# EAGLE design rc2014_16550c (EAGLE 8.1.1)
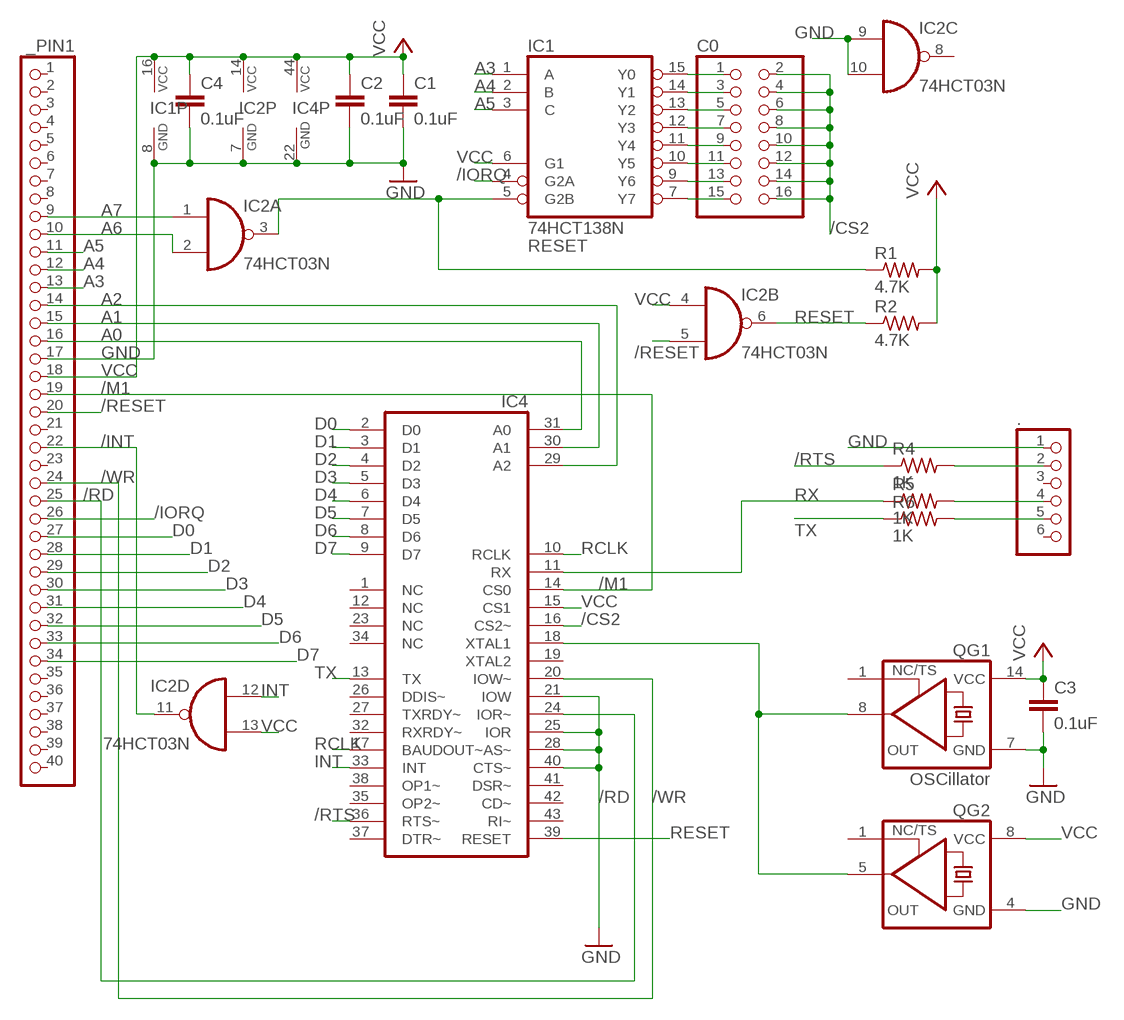
[diagram p0: schematic, sheet 1]

## Parts
.  PINHD-1X6  [1X06]
_PIN1  PINHD-1X40  [1X40]
C0  PINHD-2X8  [2X08]
C1  0.1uF  C-EU050-024X044  [C050-024X044]
C2  0.1uF  C-EU050-024X044  [C050-024X044]
C3  0.1uF  C-EU050-024X044  [C050-024X044]
C4  0.1uF  C-EU050-024X044  [C050-024X044]
IC1  74HCT138N  [DIL16]
IC2  74HCT03N  74HCT00N  [DIL14]
IC4  XR-16C550JSOCKET44  [S44]
QG1  OSCillator  XO-14  [DIL14S]
QG2  XO-8  [DIL08S]
R1  4.7K  R-US_0207/10  [0207/10]
R2  4.7K  R-US_0207/10  [0207/10]
R4  1K  R-US_0207/10  [0207/10]
R5  1K  R-US_0207/10  [0207/10]
R6  1K  R-US_0207/10  [0207/10]

## Nets
/CS2: C0.2 C0.4 C0.6 C0.8 C0.10 C0.12 C0.14 C0.16 IC4.16(CS2~)
/INT: _PIN1.22 IC2.11(D:O)
/IORQ: _PIN1.26 IC1.4(G2A)
/M1: _PIN1.19 IC4.14(CS0)
/RD: _PIN1.25 IC4.24(IOR~)
/RESET: _PIN1.20 IC2.5(B:I1)
/RTS: IC4.36(RTS~) R4.1
/WR: _PIN1.24 IC4.20(IOW~)
A0: _PIN1.16 IC4.31(A0)
A1: _PIN1.15 IC4.30(A1)
A2: _PIN1.14 IC4.29(A2)
A3: _PIN1.13 IC1.1(A)
A4: _PIN1.12 IC1.2(B)
A5: _PIN1.11 IC1.3(C)
A6: _PIN1.10 IC2.2(A:I1)
A7: _PIN1.9 IC2.1(A:I0)
CS1: IC1.5(G2B) IC2.3(A:O) R1.1
D0: _PIN1.27 IC4.2(D0)
D1: _PIN1.28 IC4.3(D1)
D2: _PIN1.29 IC4.4(D2)
D3: _PIN1.30 IC4.5(D3)
D4: _PIN1.31 IC4.6(D4)
D5: _PIN1.32 IC4.7(D5)
D6: _PIN1.33 IC4.8(D6)
D7: _PIN1.34 IC4.9(D7)
GND: ..1 _PIN1.17 C1.2 C2.2 C3.2 C4.2 IC1.8(GND) IC2.7(P:GND) IC2.9(C:I0) IC2.10(C:I1) IC4.21(IOW) IC4.22(GND) IC4.25(IOR) IC4.28(AS~) IC4.40(CTS~) QG1.7(GND) QG2.4(GND)
INT: IC2.12(D:I0) IC4.33(INT)
N$3: ..5 R6.2
N$4: ..4 R5.2
N$5: ..2 R4.2
N$6: C0.1 IC1.15(Y0)
N$7: C0.3 IC1.14(Y1)
N$8: C0.5 IC1.13(Y2)
N$9: C0.7 IC1.12(Y3)
N$10: C0.9 IC1.11(Y4)
N$11: C0.11 IC1.10(Y5)
N$12: C0.13 IC1.9(Y6)
N$13: C0.15 IC1.7(Y7)
OSC: IC4.18(XTAL1) QG1.8(OUT) QG2.5(OUT)
RCLK: IC4.10(RCLK) IC4.17(BAUDOUT~)
RESET: IC2.6(B:O) IC4.39(RESET) R2.1
RX: IC4.11(RX) R5.1
TX: IC4.13(TX) R6.1
VCC: _PIN1.18 C1.1 C2.1 C3.1 C4.1 IC1.6(G1) IC1.16(VCC) IC2.4(B:I0) IC2.13(D:I1) IC2.14(P:VCC) IC4.15(CS1) IC4.44(VCC) QG1.14(VCC) QG2.8(VCC) R1.2 R2.2
Unconnected: ..3 ..6 _PIN1.1 _PIN1.2 _PIN1.3 _PIN1.4 _PIN1.5 _PIN1.6 _PIN1.7 _PIN1.8 _PIN1.21 _PIN1.23 _PIN1.35 _PIN1.36 _PIN1.37 _PIN1.38 _PIN1.39 _PIN1.40 IC2.8(C:O) IC4.1(NC) IC4.12(NC) IC4.19(XTAL2) IC4.23(NC) IC4.26(DDIS~) IC4.27(TXRDY~) IC4.32(RXRDY~) IC4.34(NC) IC4.35(OP2~) IC4.37(DTR~) IC4.38(OP1~) IC4.41(DSR~) IC4.42(CD~) IC4.43(RI~) QG1.1(TS) QG2.1(TS)

## Library data of the parts
. = pinhead:PINHD-1X6: PIN HEADER
_PIN1 = pinhead:PINHD-1X40: PIN HEADER
C0 = pinhead:PINHD-2X8: PIN HEADER
C1-C4 = rcl:C-EU: CAPACITOR, European symbol
IC1 = 74xx-eu:74*138: 3-line to 8-line DECODER/DEMULTIPLEXER
IC2 = 74xx-eu:74*00: Quad 2-input NAND gate
IC4 = rc2014:XR-16C550J: UART/FIFO
QG1 QG2 = crystal:XO-: CRYSTAL; OC_FARNELL: unknown; OC_NEWARK: unknown
R1 R2 R4-R6 = rcl:R-US_: RESISTOR, American symbol

## Net classes
0 +5V: width 0.508 mm

## Board
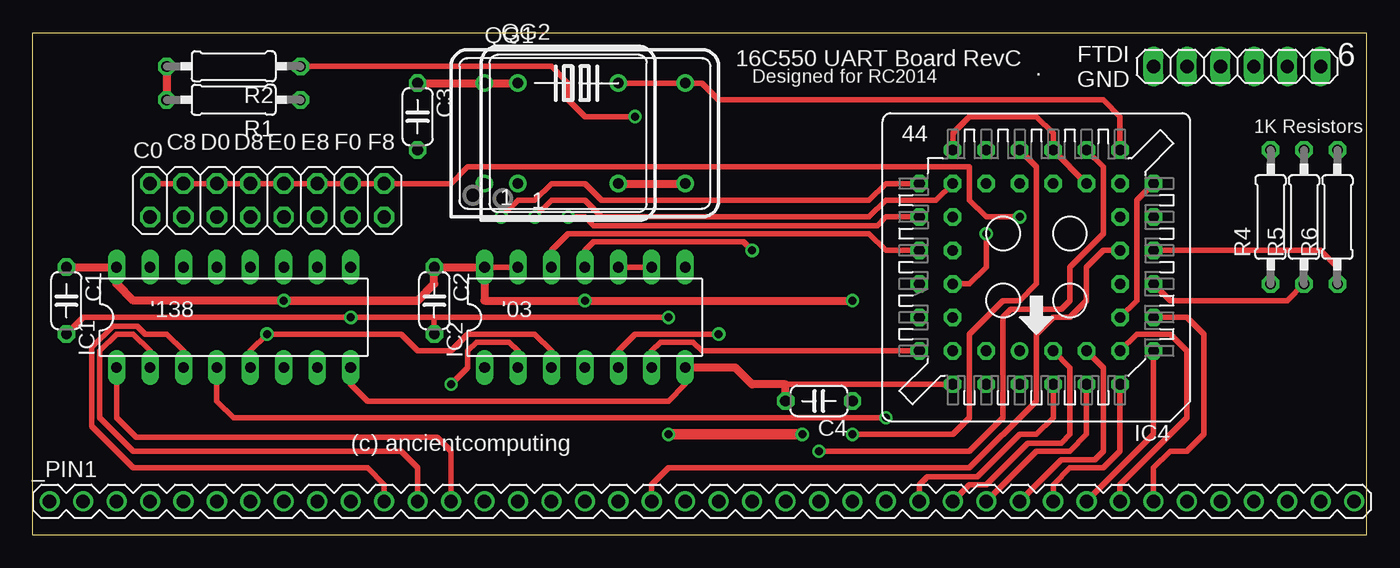
[diagram p1: board, top side]
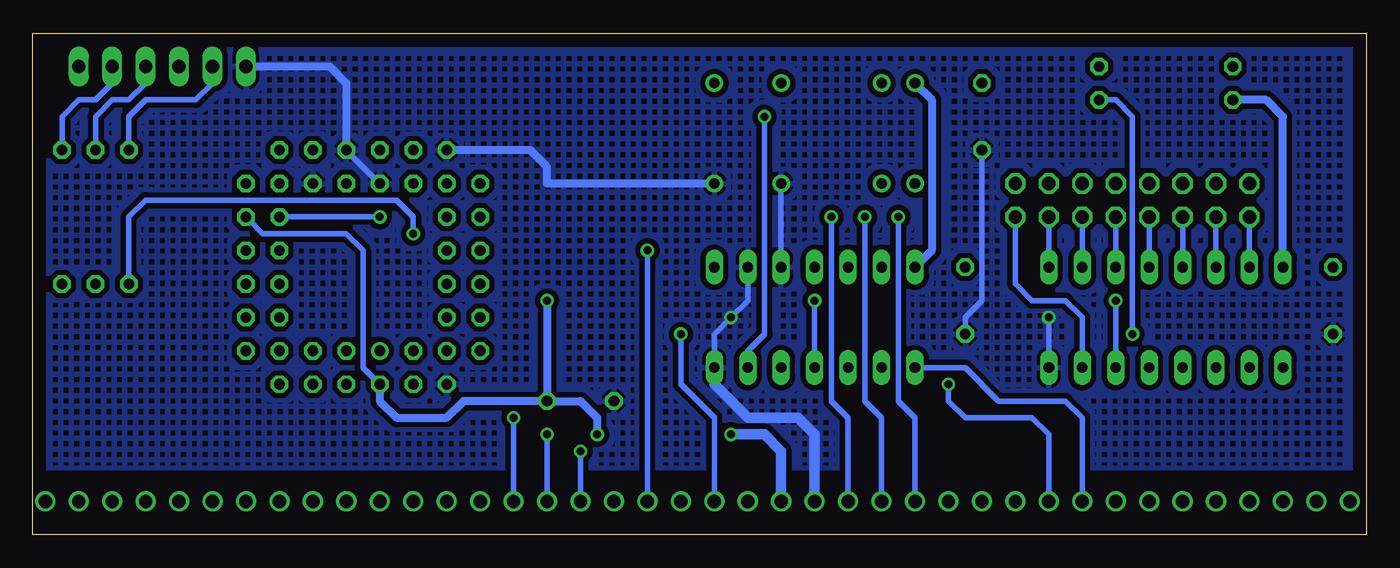
[diagram p2: board, bottom side, seen from below]

Size 101.27 x 38.1 mm. Coordinates in mm from the lower left corner, seen from the top.
Outline: 0,38.09 101.27,38.09 101.27,0 0,0 0,38.09
Outline: 0,38.09 0,38.1
Copper layers (1*16): Top 0.035mm / dielectric 1.5mm / Bottom 0.035mm
Design rules "default *": minimum track width 20mil, minimum drill 24mil, track to track 8mil, track to pad 8mil, pad to pad 8mil, via to via 8mil, smd to smd 8mil, copper to edge 40mil, drill to drill 8mil, minimum pad ring 10mil, minimum via ring 8mil, stop-mask expansion 4mil, vias tented up to drill 0mil, thermal gap 10mil

### Footprints (pad centres in the part's own frame; a part is rotated, then mirrored left to right if it is on the bottom)
1X06 = drill 1.016 long: 1 -6.35,0; 2 -3.81,0; 3 -1.27,0; 4 1.27,0; 5 3.81,0; 6 6.35,0
1X40 = drill 1.016: 1 -49.53,0; 2 -46.99,0; 3 -44.45,0; 4 -41.91,0; 5 -39.37,0; 6 -36.83,0; 7 -34.29,0; 8 -31.75,0; 9 -29.21,0; 10 -26.67,0; 11 -24.13,0; 12 -21.59,0; 13 -19.05,0; 14 -16.51,0; 15 -13.97,0; 16 -11.43,0; 17 -8.89,0; 18 -6.35,0; 19 -3.81,0; 20 -1.27,0; 21 1.27,0; 22 3.81,0; 23 6.35,0; 24 8.89,0; 25 11.43,0; 26 13.97,0; 27 16.51,0; 28 19.05,0; 29 21.59,0; 30 24.13,0; 31 26.67,0; 32 29.21,0; 33 31.75,0; 34 34.29,0; 35 36.83,0; 36 39.37,0; 37 41.91,0; 38 44.45,0; 39 46.99,0; 40 49.53,0
2X08 = drill 1.016 octagon: 1 -8.89,-1.27; 2 -8.89,1.27; 3 -6.35,-1.27; 4 -6.35,1.27; 5 -3.81,-1.27; 6 -3.81,1.27; 7 -1.27,-1.27; 8 -1.27,1.27; 9 1.27,-1.27; 10 1.27,1.27; 11 3.81,-1.27; 12 3.81,1.27; 13 6.35,-1.27; 14 6.35,1.27; 15 8.89,-1.27; 16 8.89,1.27
C050-024X044 = drill 0.813 octagon: 1 -2.54,0; 2 2.54,0
DIL16 = drill 0.813 long: 1 -8.89,-3.81; 2 -6.35,-3.81; 3 -3.81,-3.81; 4 -1.27,-3.81; 5 1.27,-3.81; 6 3.81,-3.81; 7 6.35,-3.81; 8 8.89,-3.81; 9 8.89,3.81; 10 6.35,3.81; 11 3.81,3.81; 12 1.27,3.81; 13 -1.27,3.81; 14 -3.81,3.81; 15 -6.35,3.81; 16 -8.89,3.81
DIL14 = drill 0.813 long: 1 -7.62,-3.81; 2 -5.08,-3.81; 3 -2.54,-3.81; 4 0,-3.81; 5 2.54,-3.81; 6 5.08,-3.81; 7 7.62,-3.81; 8 7.62,3.81; 9 5.08,3.81; 10 2.54,3.81; 11 0,3.81; 12 -2.54,3.81; 13 -5.08,3.81; 14 -7.62,3.81
S44 = drill 0.813: 1 1.27,6.35 | drill 0.813 octagon: 2 -1.27,8.89; 3 -1.27,6.35; 4 -3.81,8.89; 5 -3.81,6.35; 6 -6.35,8.89; 7 -8.89,6.35; 8 -6.35,6.35; 9 -8.89,3.81; 10 -6.35,3.81; 11 -8.89,1.27; 12 -6.35,1.27; 13 -8.89,-1.27; 14 -6.35,-1.27; 15 -8.89,-3.81; 16 -6.35,-3.81; 17 -8.89,-6.35; 18 -6.35,-8.89; 19 -6.35,-6.35; 20 -3.81,-8.89; 21 -3.81,-6.35; 22 -1.27,-8.89; 23 -1.27,-6.35; 24 1.27,-8.89; 25 1.27,-6.35; 26 3.81,-8.89; 27 3.81,-6.35; 28 6.35,-8.89; 29 8.89,-6.35; 30 6.35,-6.35; 31 8.89,-3.81; 32 6.35,-3.81; 33 8.89,-1.27; 34 6.35,-1.27; 35 8.89,1.27; 36 6.35,1.27; 37 8.89,3.81; 38 6.35,3.81; 39 8.89,6.35; 40 6.35,8.89; 41 6.35,6.35; 42 3.81,8.89; 43 3.81,6.35; 44 1.27,8.89
DIL14S = drill 0.813: 1 -7.62,-3.81; 7 7.62,-3.81; 8 7.62,3.81; 14 -7.62,3.81
DIL08S = drill 0.813: 1 -3.81,-3.81; 4 3.81,-3.81; 5 3.81,3.81; 8 -3.81,3.81
0207/10 = drill 0.813 octagon: 1 -5.08,0; 2 5.08,0

### Placement (x,y rotation side)
.  91.44,35.56 0 top
_PIN1  50.8,2.54 0 top
C0  17.78,25.4 0 top
C1  2.54,17.78 270 top
C2  30.48,17.78 270 top
C3  29.21,31.75 270 top
C4  59.69,10.16 180 top
IC1  15.24,16.51 0 top
IC2  41.91,16.51 0 top
IC4  76.2,20.32 180 top
QG1  41.91,30.48 0 top
QG2  40.64,30.48 0 top
R1  15.24,33.02 180 top
R2  15.24,35.56 180 top
R4  93.98,24.13 90 top
R5  96.52,24.13 90 top
R6  99.06,24.13 90 top

### Tracks (layer width: path | path; a pad name or v marks a point on that pad's centre or on a via)
/CS2  (via drill 0.61)
  Top 0.406: C0.2 C0.4 C0.6 C0.8 C0.10 C0.12 C0.14 C0.16 31.75,26.67 33.02,27.94 71.12,27.94 71.12,25.4 72.39,24.13 v74.93,24.13
  Bottom 0.406: v74.93,24.13 IC4.16
/INT  (via drill 0.61)
  Top 0.406: IC2.11 41.91,21.59 42.57,22.25 53.95,22.25 v54.61,21.59
  Bottom 0.406: _PIN1.22 v54.61,21.59
/IORQ  (via drill 0.61)
  Top 0.406: v64.77,8.89 15.24,8.89 13.97,10.16 IC1.4
  Bottom 0.406: _PIN1.26 v64.77,8.89
/M1
  Top 0.406: IC4.14 81.28,21.59 80.01,20.32 80.01,17.78 78.74,16.51 77.47,16.51 76.2,15.24 76.2,10.16 71.12,5.08 48.26,5.08 46.99,3.81 _PIN1.19
/RD  (via drill 0.61)
  Top 0.406: IC4.24 76.2,27.94 76.2,19.05 74.93,17.78 73.66,17.78 71.12,15.24 71.12,8.89 69.85,7.62 v62.23,7.62
  Bottom 0.406: _PIN1.25 v62.23,7.62
/RESET  (via drill 0.61)
  Top 0.406: IC2.5 44.45,13.97 45.72,15.24 v52.07,15.24
  Bottom 0.406: _PIN1.20 49.53,8.89 52.07,11.43 v52.07,15.24
/RTS  (via drill 0.61)
  Top 0.406: v72.39,22.86 72.39,20.32 71.12,19.05 IC4.36
  Bottom 0.406: R4.1 93.98,24.13 92.71,25.4 73.66,25.4 72.39,24.13 v72.39,22.86
/WR  (via drill 0.61)
  Top 0.406: IC4.20 81.28,27.94 81.28,22.86 78.74,20.32 78.74,17.78 78.08,17.12 74.27,17.12 73.66,16.51 73.66,8.89 71.12,6.35 v59.69,6.35
  Bottom 0.406: _PIN1.24 v59.69,6.35
A0  (via drill 0.61)
  Top 0.406: v40.64,24.13 41.91,24.13 42.57,23.47 64.11,23.47 64.77,24.13 IC4.31
  Bottom 0.406: _PIN1.16 39.37,8.89 40.64,10.16 v40.64,24.13
A1  (via drill 0.61)
  Top 0.406: v38.1,24.13 39.37,25.4 41.91,25.4 43.18,24.13 63.5,24.13 64.77,25.4 68.58,25.4 IC4.30
  Bottom 0.406: _PIN1.15 36.83,8.89 38.1,10.16 v38.1,24.13
A2  (via drill 0.61)
  Top 0.406: v35.56,24.13 36.83,25.4 38.1,25.4 39.37,26.67 41.91,26.67 43.18,25.4 63.5,25.4 64.77,26.67 IC4.29
  Bottom 0.406: _PIN1.14 34.29,8.89 35.56,10.16 v35.56,24.13
A3
  Top 0.406: _PIN1.13 31.75,6.35 30.69,7.41 7.83,7.41 6.35,8.89 IC1.1
A4
  Top 0.406: _PIN1.12 29.21,5.08 27.94,6.35 7.62,6.35 5.08,8.89 5.08,13.97 6.35,15.24 7.62,15.24 8.89,13.97 IC1.2
A5
  Top 0.406: _PIN1.11 26.67,3.81 25.4,5.08 7.62,5.08 4.47,8.23 4.47,8.28 4.47,8.89 4.47,14.22 6.1,15.85 7.91,15.85 8.52,15.24 10.16,15.24 11.43,13.97 IC1.3
A6  (via drill 0.61)
  Top 0.406: IC2.2 36.83,13.97 36.17,14.63 33.68,14.63 33.02,13.97 33.02,12.7 v31.75,11.43
  Bottom 0.406: _PIN1.10 24.13,7.62 25.4,8.89 30.48,8.89 31.75,10.16 v31.75,11.43
A7
  Bottom 0.406: _PIN1.9 21.59,8.89 22.86,10.16 27.94,10.16 30.48,12.7 IC2.1
CS1  (via drill 0.61)
  Top 0.406: IC2.3 39.37,13.97 38.1,15.24 33.02,15.24 31.75,13.97 29.21,13.97 27.94,15.24 v17.78,15.24 16.51,13.97 IC1.5
  Bottom 0.406: R1.1 19.05,33.02 17.78,31.75 v17.78,15.24
D0
  Top 0.406: IC4.2 77.47,8.89 76.2,7.62 74.93,7.62 71.73,4.42 67.92,4.42 67.31,3.81 _PIN1.27
D1
  Top 0.406: IC4.3 78.74,12.7 78.74,7.62 78.08,6.96 75.54,6.96 72.39,3.81 71.12,3.81 _PIN1.28
D2
  Top 0.406: IC4.4 80.01,7.62 78.74,6.35 76.2,6.35 _PIN1.29
D3
  Top 0.406: IC4.5 81.28,12.7 81.28,6.35 80.62,5.69 78.08,5.69 _PIN1.30
D4
  Top 0.406: _PIN1.31 77.47,3.81 78.74,5.08 81.28,5.08 82.55,6.35 IC4.6
D5
  Top 0.406: IC4.7 85.09,7.62 _PIN1.32
D6
  Top 0.406: IC4.8 83.82,15.24 86.36,15.24 87.63,13.97 87.63,8.89 82.55,3.81 _PIN1.33
D7
  Top 0.406: _PIN1.34 85.09,5.08 86.36,6.35 87.63,6.35 88.9,7.62 88.9,15.24 87.63,16.51 IC4.9
GND  (via drill 0.61)
  Top 0.406: IC2.10 IC2.9 | IC2.7 49.53,11.43 48.26,10.16 25.4,10.16 24.13,11.43 IC1.8 | 30.48,16.51 v48.26,16.51 | 30.48,16.51 C2.2 | C1.2 3.81,16.51 v24.13,16.51 30.48,16.51 | 55.88,11.43 57.15,11.43 IC4.40 | IC4.21 IC4.22 77.47,30.48 76.2,31.75 71.12,31.75 69.85,30.48 IC4.28
  Top 0.61: QG2.4 QG1.7 | C4.2 57.15,11.43 54.61,11.43 53.34,12.7 IC2.7
  Bottom 0.406: IC2.9 46.99,17.78 v48.26,16.51 49.53,15.24 IC2.7 | IC1.8 v24.13,16.51 | C2.2 30.48,16.51 29.21,17.78 C3.2 | QG2.4 IC2.10 | IC4.22 IC4.25
  Bottom 0.61: ..1 78.74,35.56 77.47,34.29 IC4.22 | QG1.7 62.23,26.67 62.23,27.94 63.5,29.21 IC4.28
  Bottom 0.813: _PIN1.17 41.91,7.62 43.18,8.89 46.99,8.89 49.53,11.43 IC2.7
  pour Bottom (isolate 0.406, hatched): 0,38.1 0,5.08 101.6,5.08 101.6,38.1
INT
  Top 0.406: IC2.12 39.37,21.59 40.64,22.86 63.5,22.86 64.77,21.59 IC4.33
N$3
  Bottom 0.406: ..5 95.25,34.29 96.52,33.02 97.79,33.02 99.06,31.75 R6.2
N$4
  Bottom 0.406: ..4 92.71,34.29 93.98,33.02 95.25,33.02 96.52,31.75 R5.2
N$5
  Bottom 0.406: ..2 87.63,34.29 88.9,33.02 92.71,33.02 93.98,31.75 R4.2
N$6
  Bottom 0.406: C0.1 IC1.15
N$7
  Bottom 0.406: C0.3 IC1.14
N$8
  Bottom 0.406: C0.5 IC1.13
N$9
  Bottom 0.406: C0.7 IC1.12
N$10
  Bottom 0.406: C0.9 IC1.11
N$11
  Bottom 0.406: C0.11 IC1.10
N$12
  Bottom 0.406: C0.13 IC1.9
N$13
  Bottom 0.406: IC1.7 21.59,16.51 22.86,17.78 25.4,17.78 26.67,19.05 C0.15
OSC
  Top 0.406: QG2.5 QG1.8 50.8,34.29 52.07,33.02 81.28,33.02 82.55,31.75 IC4.18
RCLK
  Top 0.406: IC4.10 83.82,17.78 83.82,25.4 IC4.17
RESET  (via drill 0.61)
  Top 0.406: IC4.39 50.8,13.97 50.14,14.63 47.65,14.63 46.99,13.97 IC2.6 | R2.1 39.37,35.56 40.64,34.29 40.64,33.02 41.91,31.75 v45.72,31.75
  Bottom 0.406: IC2.6 46.99,13.97 45.72,15.24 v45.72,31.75
RX
  Top 0.406: R5.1 95.25,17.78 86.36,17.78 IC4.11
TX
  Top 0.406: R6.1 99.06,20.32 97.79,21.59 IC4.13
VCC  (via drill 0.61)
  Top 0.406: IC2.13 IC2.14
  Top 0.61: C1.1 IC1.16 6.35,19.05 7.62,17.78 29.21,17.78 | R2.2 R1.2 | C3.1 QG1.14 QG2.8 | v62.23,17.78 v41.91,17.78 34.29,17.78 IC2.14 C2.1 30.48,19.05 29.21,17.78 | v19.05,17.78 29.21,17.78
  Top 0.813: v48.26,7.62 v58.42,7.62
  Bottom 0.406: IC4.44 76.2,12.7 76.2,21.59 77.47,22.86 83.82,22.86 IC4.15 | IC1.6 v19.05,17.78 | IC2.4 v41.91,17.78
  Bottom 0.61: IC1.16 6.35,31.75 7.62,33.02 R1.2 | IC4.44 74.93,10.16 73.66,8.89 69.85,8.89 68.58,10.16 C4.1 | C4.1 59.69,10.16 58.42,8.89 v58.42,7.62 | v62.23,17.78 C4.1 | QG1.14 33.02,33.02 33.02,21.59 IC2.14
  Bottom 0.813: _PIN1.18 44.45,6.35 45.72,7.62 v48.26,7.62

### Text on the board
tNames: 16C550 UART Board RevC | FTDI / GND | 6 | Designed for RC2014 | 1K Resistors | C8 | D0 | D8 | E0 | E8 | F0 | F8 | '138 | '03 | (c) ancientcomputing